# Altium schematic sheet PAGE1-CONTENTS.SchDoc
size A3
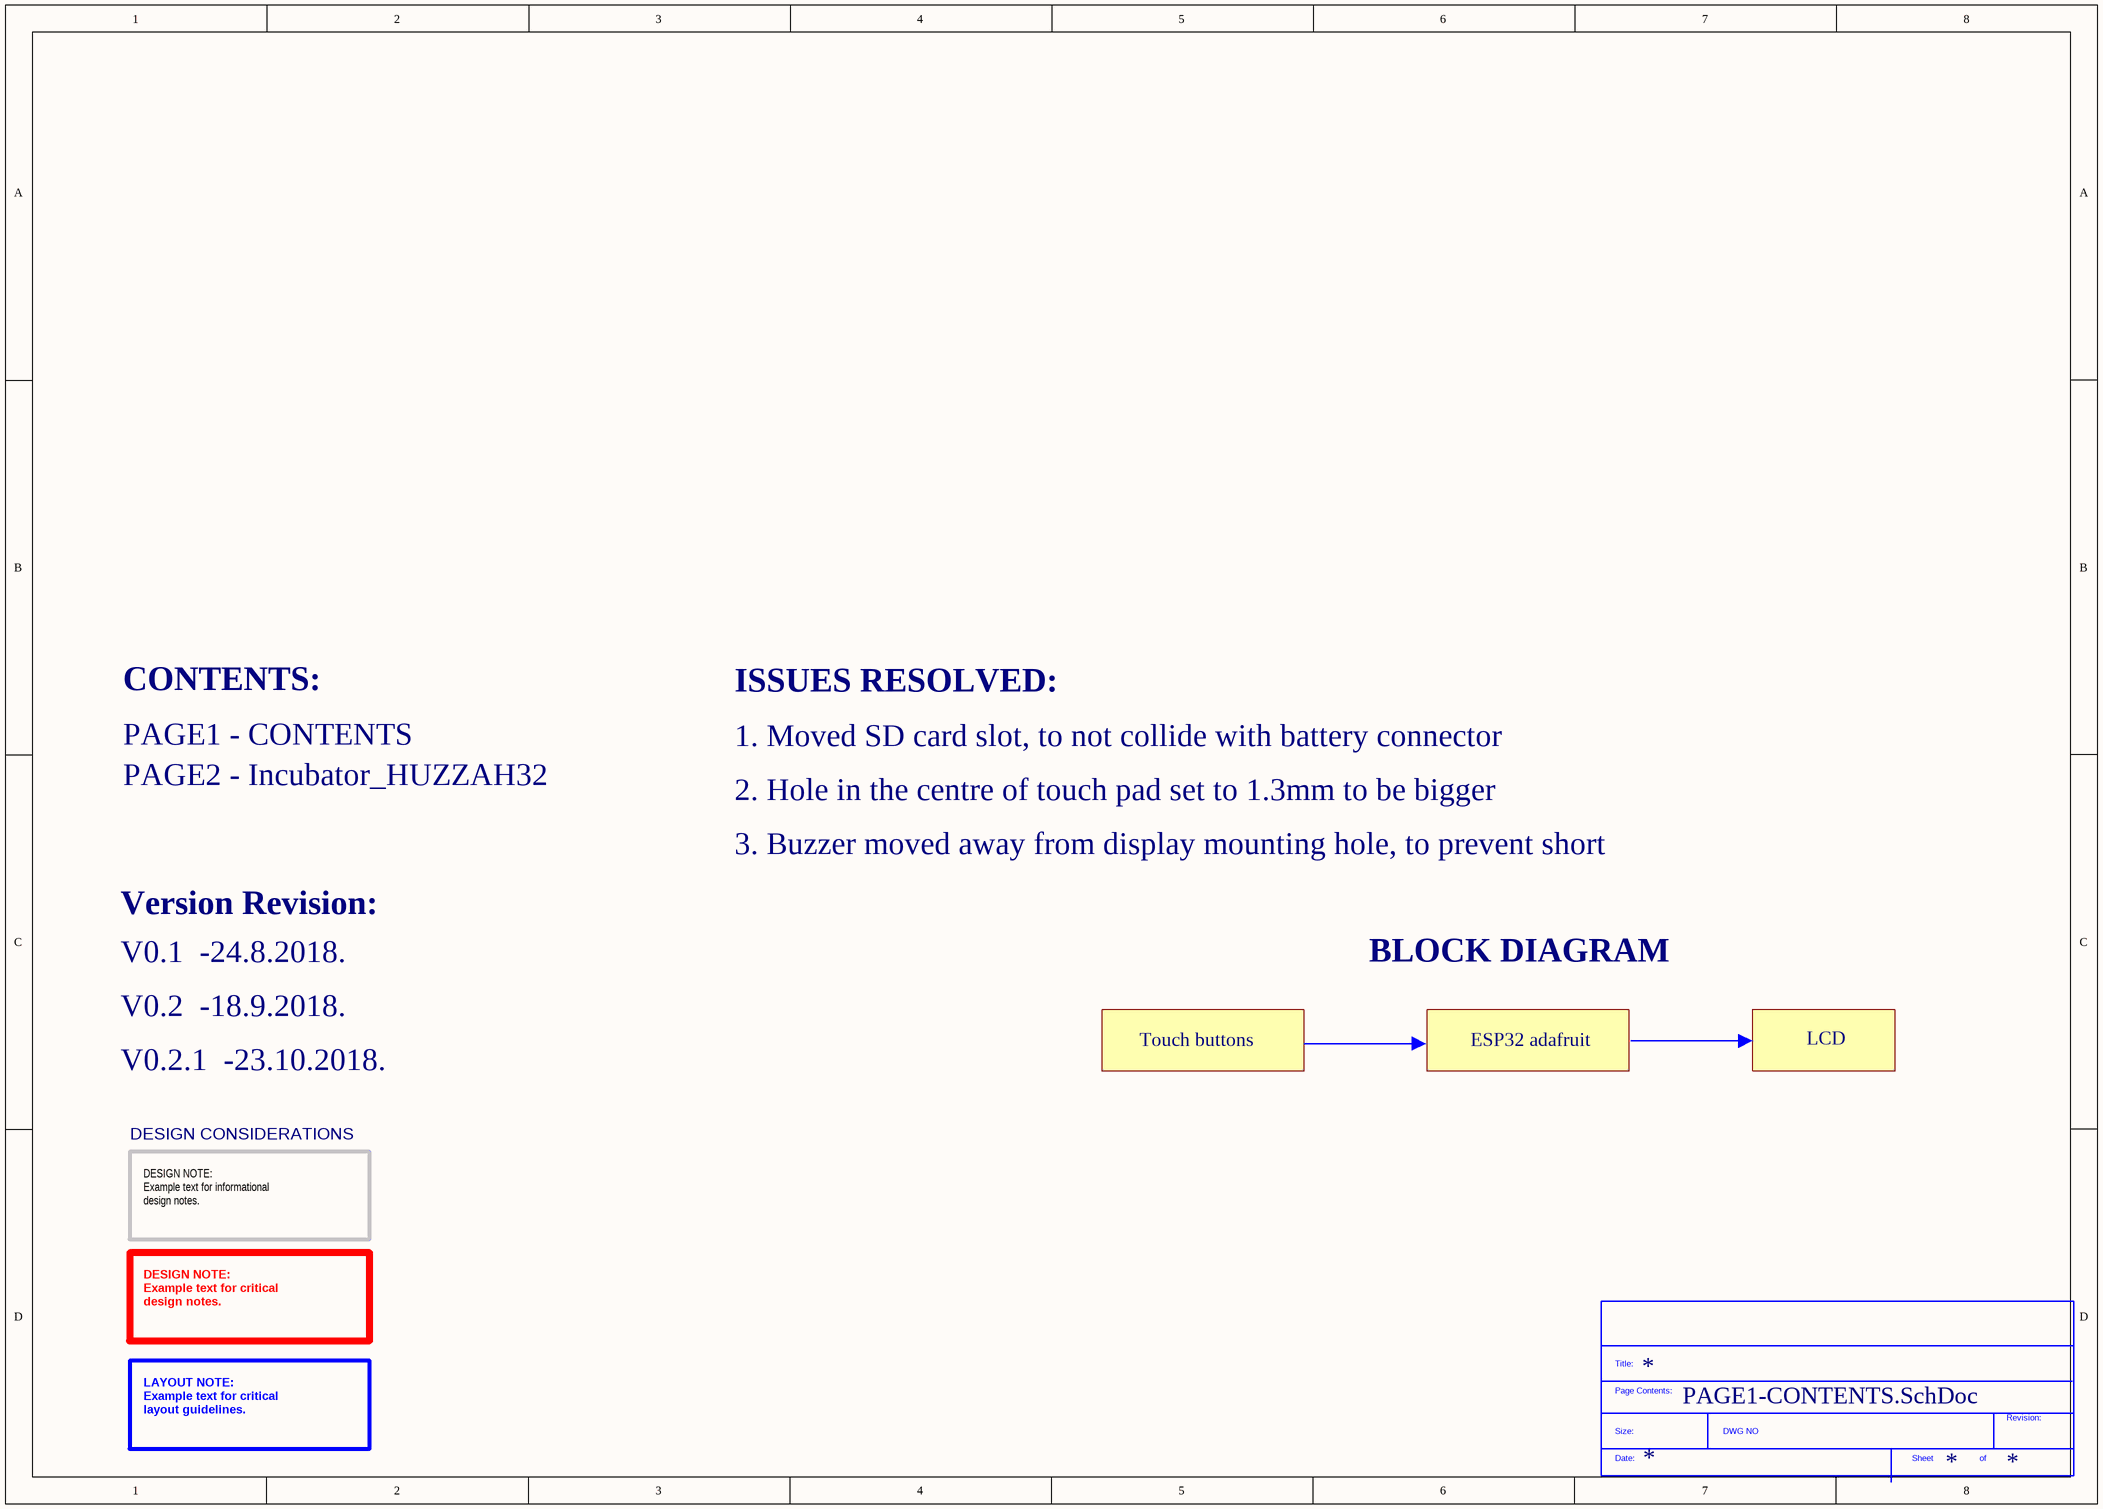
[diagram p0: PAGE1-CONTENTS.SchDoc]

## Parts
*?  SDTitleBlock  (value not drawn)  (graphical)

## Notes on the sheet
- CONTENTS:
- ISSUES RESOLVED:
- PAGE1 - CONTENTS
- PAGE2 - Incubator_HUZZAH32
- 1. Moved SD card slot, to not collide with battery connector
- 2. Hole in the centre of touch pad set to 1.3mm to be bigger
- 3. Buzzer moved away from display mounting hole, to prevent short
- Version Revision:
- V0.1  -24.8.2018.
- BLOCK DIAGRAM
- V0.2  -18.9.2018.
- Touch buttons
- ESP32 adafruit
- LCD
- V0.2.1  -23.10.2018.
- DESIGN CONSIDERATIONS
- DESIGN NOTE:
  Example text for informational
  design notes.
- DESIGN NOTE:
  Example text for critical
  design notes.
- LAYOUT NOTE:
  Example text for critical
  layout guidelines.
- (in symbol SDTitleBlock) Title:; Page Contents:; Revision:; Size:; DWG NO; Date:; Sheet; of